# Altium schematic sheet fpga-bank8.SchDoc: CS - FPGA - Bank 8
size Letter; CheckedBy: J. Brinton; CompanyName: Signal Laboratories, Inc.; DrawnBy: J. Brinton; Engineer: J. Brinton; Address1: 3479 Edison Way; Address2: Menlo Park CA 94025; Address3: +1 (877) 778-8435; Address4: siglabs.com; Revision: 3; SheetNumber: 12; SheetTotal: 47
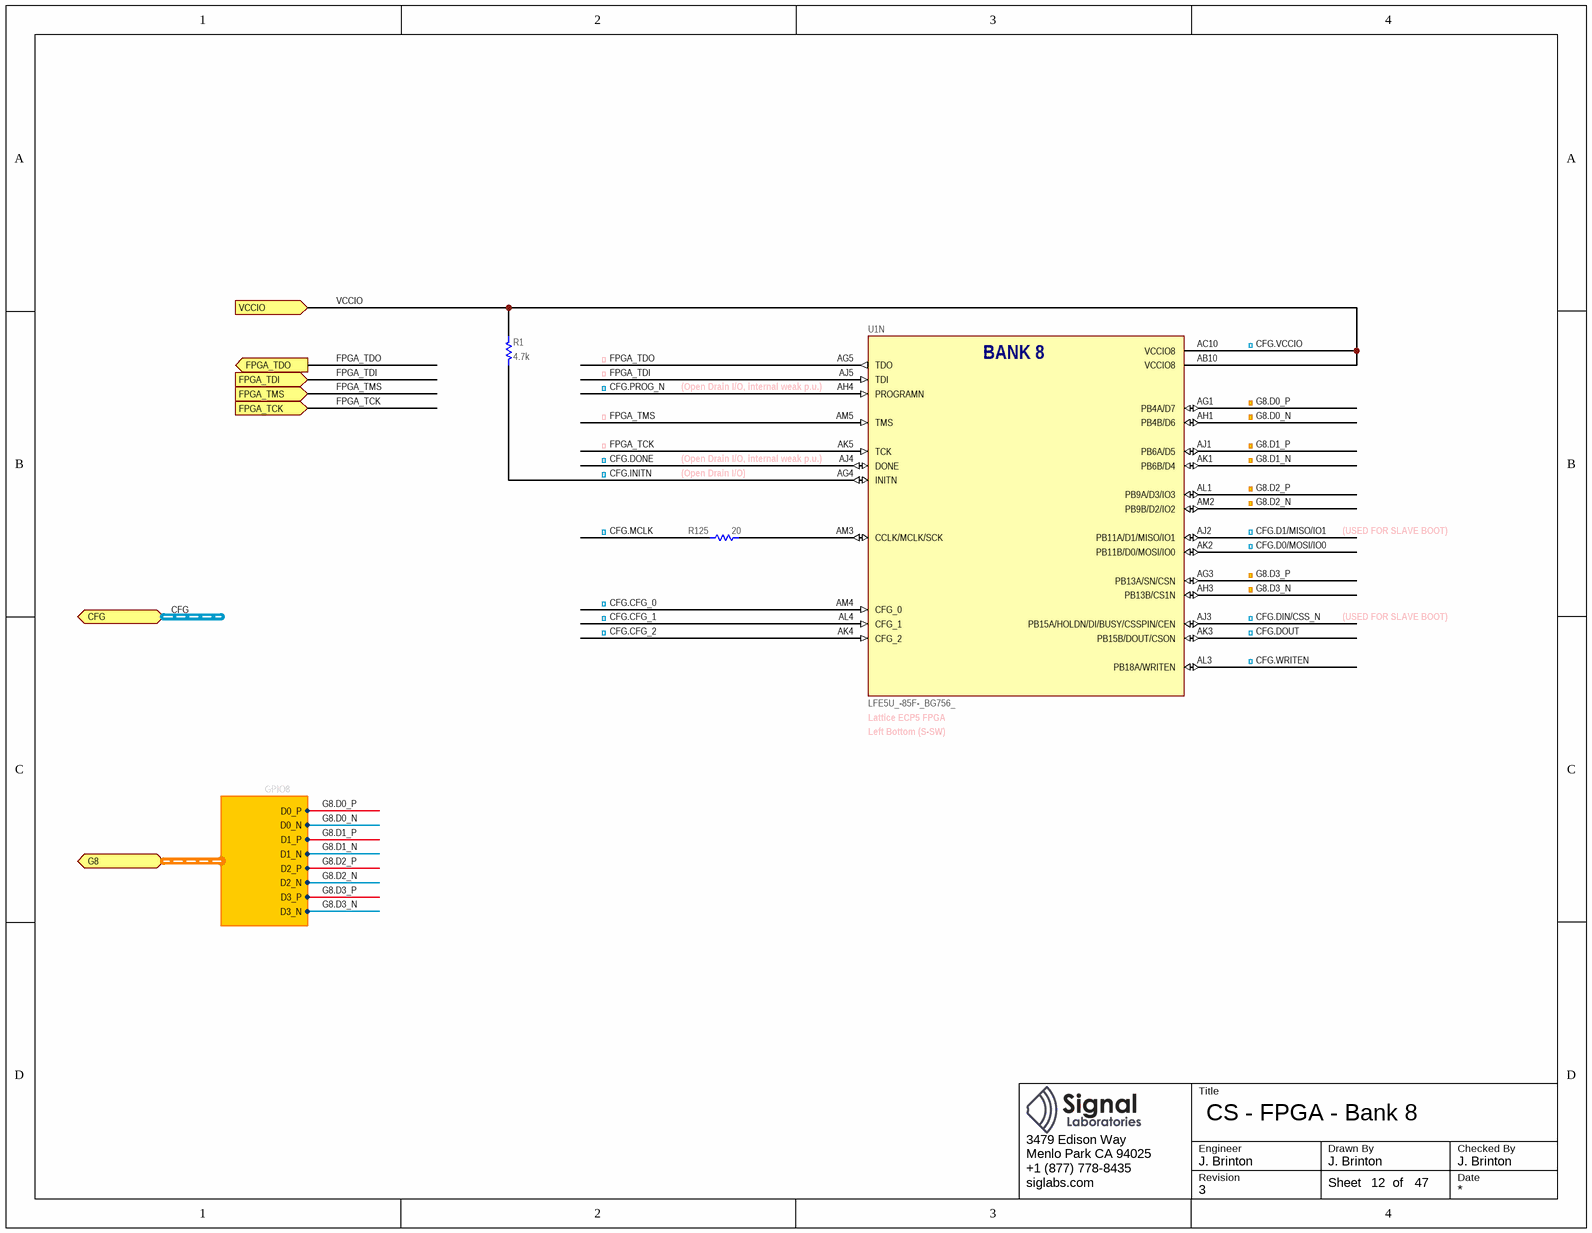
[diagram p0: fpga-bank8.SchDoc]

## Parts
R1  value 4.7k  [RESC1005X40N]  (hidden comment: ERJ-2RKF4701X)
R125  value 20  [RESC1005X40N]  (hidden comment: ERJ-2RKF20R0X)
U1  LFE5U_-85F-_BG756_  [caBGA756]  (part N of 19)

## Ports
CFG (harness CFG), FPGA_TCK (in), FPGA_TDI (in), FPGA_TDO (out), FPGA_TMS (in), G8 (harness GPIO8), VCCIO (in)

## Harnesses
GPIO8: D0_P, D0_N, D1_P, D1_N, D2_P, D2_N, D3_P, D3_N

## Nets
CFG.CFG_0: U1.AM4(CFG_0)
CFG.CFG_1: U1.AL4(CFG_1)
CFG.CFG_2: U1.AK4(CFG_2)
CFG.D0/MOSI/IO0: U1.AK2(PB11B/D0/MOSI/IO0)
CFG.D1/MISO/IO1: U1.AJ2(PB11A/D1/MISO/IO1)
CFG.DIN/CSS_N: U1.AJ3(PB15A/HOLDN/DI/BUSY/CSSPIN/CEN)
CFG.DONE: U1.AJ4(DONE)
CFG.DOUT: U1.AK3(PB15B/DOUT/CSON)
CFG.INITN: R1.1 U1.AG4(INITN)
CFG.MCLK: R125.1
CFG.PROG_N: U1.AH4(PROGRAMN)
CFG.VCCIO: R1.2 U1.AB10(VCCIO8) U1.AC10(VCCIO8) ; port VCCIO  [also labelled VCCIO]
CFG.WRITEN: U1.AL3(PB18A/WRITEN)
FPGA_TCK: U1.AK5(TCK) ; port FPGA_TCK
FPGA_TDI: U1.AJ5(TDI) ; port FPGA_TDI
FPGA_TDO: U1.AG5(TDO) ; port FPGA_TDO
FPGA_TMS: U1.AM5(TMS) ; port FPGA_TMS
G8.D0_N: U1.AH1(PB4B/D6) ; port G8.D0_N
G8.D0_P: U1.AG1(PB4A/D7) ; port G8.D0_P
G8.D1_N: U1.AK1(PB6B/D4) ; port G8.D1_N
G8.D1_P: U1.AJ1(PB6A/D5) ; port G8.D1_P
G8.D2_N: U1.AM2(PB9B/D2/IO2) ; port G8.D2_N
G8.D2_P: U1.AL1(PB9A/D3/IO3) ; port G8.D2_P
G8.D3_N: U1.AH3(PB13B/CS1N) ; port G8.D3_N
G8.D3_P: U1.AG3(PB13A/SN/CSN) ; port G8.D3_P
NetR125_2: R125.2 U1.AM3(CCLK/MCLK/SCK)

## Buses and harness runs
harness CFG = port CFG

## Notes on the sheet
- (near U1) (Open Drain I/O, internal weak p.u.)
- (Open Drain I/O)
- (USED FOR SLAVE BOOT)
- Left Bottom (S-SW)
- (near U1) Lattice ECP5 FPGA
- Title
- Engineer
- Revision
- Drawn By
- Checked By
- Date
- Sheet
- of
- (in symbol LFE5U_-85F-_BG756_, part N) BANK 8

## Library data of the parts
R1 = RES: Thick Film Resistor 4.7k ±1% 0.1W 75V 0402; Manufacturer: Panasonic; Tcr: ±100; Tr: -55:155; Voltage: 75; Power: 0.1; Tolerance: ±1%; Manufacturer P/N: ERJ-2RKF4701X; Alternatives: *; Footprint: *; Package: 0402
R125 = RES: Thick Film Resistor 20 ±1% 0.1W 75V 0402; Manufacturer: Panasonic; Tcr: ±100; Tr: -55:155; Voltage: 75; Power: 0.1; Tolerance: ±1%; Manufacturer P/N: ERJ-2RKF20R0X; Alternatives: *; Footprint: *; Package: 0402
U1 = LFE5U_-85F-_BG756_: ECP5 FPGA, 85k LUT, 756-caBGA; Manufacturer: Lattice Semiconductor; Manufacturer P/N: LFE5U_-85F-_BG756_